# Altium schematic sheet soldererboutdisplay.SchDoc
size A4; SheetNumber: 3; SheetTotal: 3
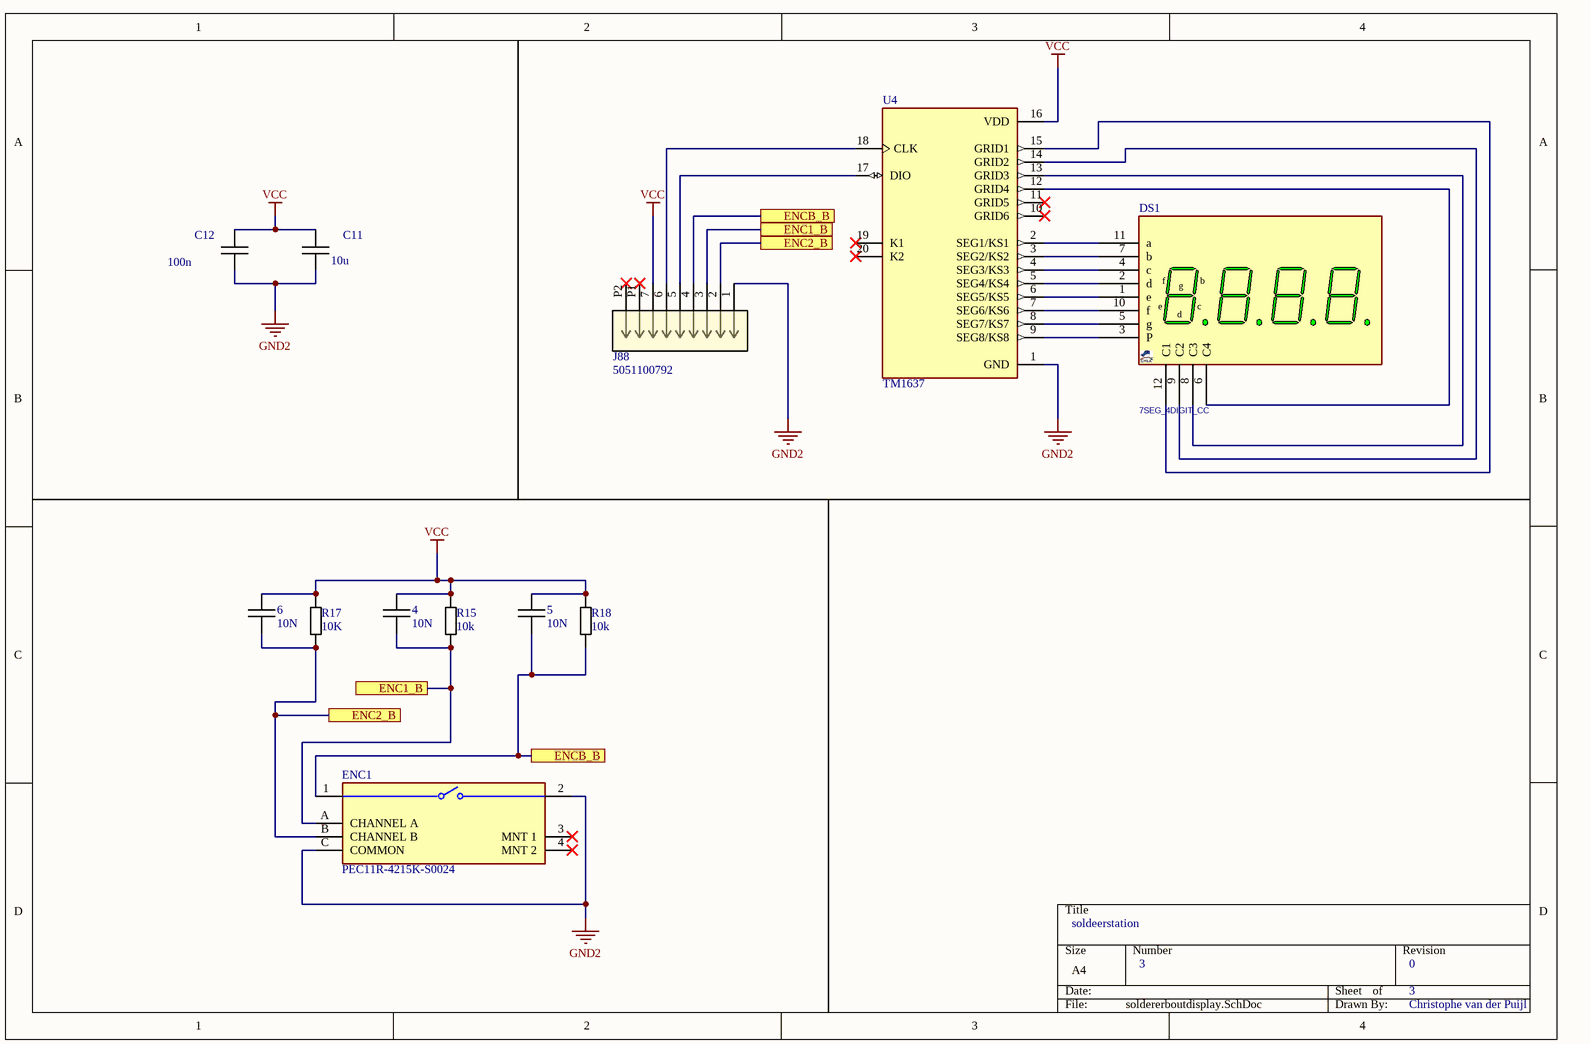
[diagram p0: soldererboutdisplay.SchDoc]

## Parts
4  10N  [C 0603 / 1608]
5  10N  [C 0603 / 1608]
6  10N  [C 0603 / 1608]
C11  10u  [C 0603 / 1608]
C12  100n  [C 0603 / 1608]
DS1  7SEG_4DIGIT_CC  [7SEGX4_12]
ENC1  PEC11R-4215K-S0024  [FP-PEC11R-4215K-S0024-MFG]
J88  5051100792  [CON_5051100792_MOL]
R15  10k  [R 0603]
R17  10K  [R 0603]
R18  10k  [R 0603]
U4  TM1637  [DIP778W43P254L2612H431Q20N]

## Ports
ENC1_B (see soldererboutdisplay[1C]), ENC1_B (see soldererboutdisplay[2A]), ENC2_B (see soldererboutdisplay[1C]), ENC2_B (see soldererboutdisplay[2A]), ENCB_B (see soldererboutdisplay[2A]), ENCB_B (see soldererboutdisplay[2C])

## Nets
GND2: C11.2 C12.2 ENC1.2 ENC1.C(COMMON) J88.1 U4.1(GND)
VCC: 4.2 5.2 6.2 C11.1 C12.1 J88.7 R15.2 R17.2 R18.2 U4.16(VDD)
ENC1_B: 4.1 ENC1.A(CHANNEL_A) J88.3 R15.1 ; port ENC1_B
ENC2_B: 6.1 ENC1.B(CHANNEL_B) J88.2 R17.1 ; port ENC2_B
ENCB_B: 5.1 ENC1.1 J88.4 R18.1 ; port ENCB_B
NetDS1_1: DS1.1(e) U4.6(SEG5/KS5)
NetDS1_2: DS1.2(d) U4.5(SEG4/KS4)
NetDS1_3: DS1.3(P) U4.9(SEG8/KS8)
NetDS1_4: DS1.4(c) U4.4(SEG3/KS3)
NetDS1_5: DS1.5(g) U4.8(SEG7/KS7)
NetDS1_6: DS1.6(C4) U4.12(GRID4)
NetDS1_7: DS1.7(b) U4.3(SEG2/KS2)
NetDS1_8: DS1.8(C3) U4.13(GRID3)
NetDS1_9: DS1.9(C2) U4.14(GRID2)
NetDS1_10: DS1.10(f) U4.7(SEG6/KS6)
NetDS1_11: DS1.11(a) U4.2(SEG1/KS1)
NetDS1_12: DS1.12(C1) U4.15(GRID1)
NetJ88_5: J88.5 U4.17(DIO)
NetJ88_6: J88.6 U4.18(CLK)

Not connected (* = marked no-connect by the designer): ENC1 3(MNT_1)* 4(MNT_2)*; J88 P1* P2*; U4 10(GRID6)* 11(GRID5)* 19(K1)* 20(K2)*

## Notes on the sheet
- soldeerstation
- 3
- 0
- Christophe van der Puijl

## Library data of the parts
4-6 C11 C12 = Capacitor
DS1 = 7SEG_4DIGIT_CC: 7SEGMENT, 4DIGIT, common cathode 5641; MANF_P#: DPY-4CK; VALUE: 7SEG_4DIGIT_CC
ENC1 = pec11r425fs0024: ROTARY ENCODER MECHANICAL 24PPR; Built in Switch: Yes; Output Type: Quadrature; Pulses per Revolution: 24; Number of Channels: 2; Max Supply Voltage (DC): 5V; Hole Diameter: 1.8mm; Packaging: Bulk; Series: PEC11R; REACH SVHC: No SVHC; Mount: Through Hole; RoHS Compliant: Yes; Length: 21.5mm; Termination: PC Pin; Width: 12.5mm; Min Operating Temperature: -30°C; Package Quantity: 150; Orientation: Vertical; Encoder Type: Mechanical; Height: 13.4mm; Detent: Yes; Max Operating Temperature: 70°C
J88 = 5051100792: No Description Available; Mfr_Name: Molex Connector Corporation; RefDes: RefDes; Type: Type
R15 R17 R18 = Resistor
U4 = TM1637: LED Drive Control Special Circuit; MF: Titan Micro Electronics; Package: Package; Availability: Not in stock; SnapEDA_Link: https://www.snapeda.com/parts/TM1637/Titan+Micro+Electronics/view-part/?ref=snap; MP: TM1637; Check_prices: https://www.snapeda.com/parts/TM1637/Titan+Micro+Electronics/view-part/?ref=eda; Value: *; Price: None